# Altium schematic sheet SCH1.SchDoc
size A4
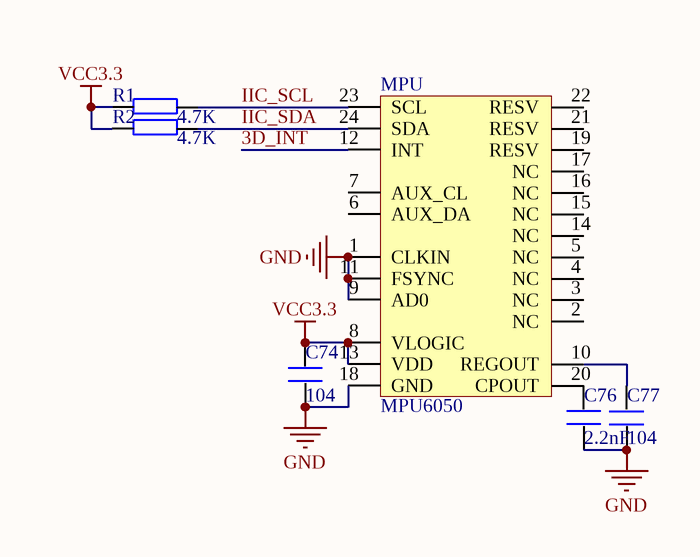
[diagram p0: SCH1.SchDoc]

## Parts
C74  104  [C 0603_L]
C76  2.2nF  [C 0603_L]
C77  104  [C 0603_L]
MPU  MPU6050  [QFN24 4x4_N]
R1  4.7K  [R 0603_L]
R2  4.7K  [R 0603_L]

## Nets
GND: C74.1 C76.1 C77.2 MPU.1(CLKIN) MPU.9(AD0) MPU.11(FSYNC) MPU.18(GND)
VCC3.3: C74.2 MPU.8(VLOGIC) MPU.13(VDD) R1.2 R2.2
3D_INT: MPU.12(INT)
IIC_SCL: MPU.23(SCL) R1.1
IIC_SDA: MPU.24(SDA) R2.1
NetC76_2: C76.2 MPU.20(CPOUT)
NetC77_1: C77.1 MPU.10(REGOUT)

Not connected (* = marked no-connect by the designer): MPU 2(NC) 3(NC) 4(NC) 5(NC) 6(AUX_DA) 7(AUX_CL) 14(NC) 15(NC) 16(NC) 17(NC) 19(RESV) 21(RESV) 22(RESV)

## Library data of the parts
C74 C76 C77 = C
MPU = MPU6050: 9轴运动处理传感器
R1 R2 = R